# Altium schematic sheet 1-wire.SchDoc
size A4
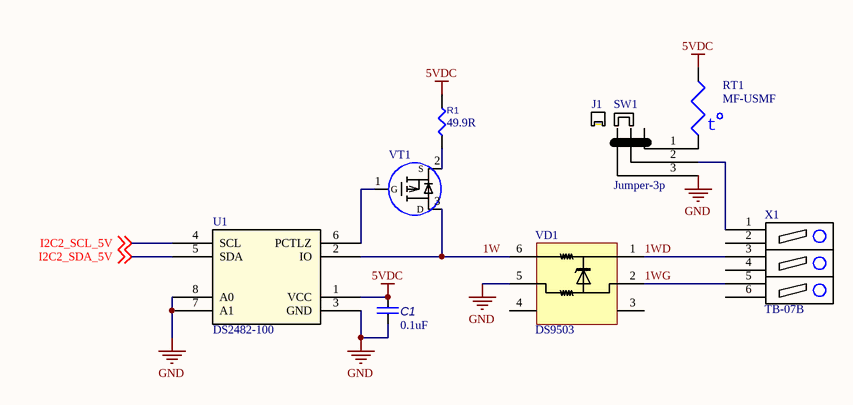
[diagram p0: 1-wire.SchDoc]

## Parts
C1  value 0.1uF  [CC1608-0603]  (hidden comment: C0603)
J1  Jumper-cap  (value not drawn)
R1  value 49.9R  [RESC1608X55N]  (hidden comment: R0603)
RT1  MF-USMF  [MF-USMF]
SW1  Jumper-3p  [pls-3]
U1  DS2482-100  [SOIC127P600X175-8N]
VD1  DS9503  [tsoc6]
VT1  P-FET SOT-23  [SO-G3]  (value not drawn)
X1  TB-07B  [TB-07B]

## Nets
5VDC: C1.1 R1.2 RT1.1 U1.1(VCC)
GND: C1.2 SW1.3 U1.3(GND) U1.7(A1) U1.8(A0) VD1.5
1W: U1.2(IO) VD1.6 VT1.3(D)
1WD: VD1.1 X1.3
1WG: VD1.2 X1.5
I2C2_SCL_5V: U1.4(SCL) ; off-sheet I2C2_SCL_5V
I2C2_SDA_5V: U1.5(SDA) ; off-sheet I2C2_SDA_5V
NetR1_1: R1.1 VT1.2(S)
NetRT1_2: RT1.2 SW1.1
NetSW1_2: SW1.2 X1.1
NetU1_6: U1.6(PCTLZ) VT1.1(G)

Not connected (* = marked no-connect by the designer): VD1 3 4; X1 2 4 6

## Notes on the sheet
- (in symbol MF-USMF) t

## Library data of the parts
J1 = Jumper-cap: Jumper; P/N: MJ-0
RT1 = MF-USMF: PTC Resettable Fuses; Manufacturer: Bourns; P/N: MF-USMF050
SW1 = Jumper-3p: PLS-3 2.54mm pin connector; P/N: PLS-3
U1 = DS2482-100: I2C - 1-Wire master single channel; P/N: DS2482S-100+
VD1 = DS9503: ESD Protection Diode with Resistors; P/N: DS9503P+
VT1 = P-FET SOT-23: P-FET transistor in SOT-23-3 package; P/N: IRLML6402PbF
X1 = TB-07B: Terminal Block 3 pos; P/N: TB-07B
C1 = C0603: P/N: *
R1 = R0603: P/N: *